# EAGLE design STorM32 Micro Logger v132 micro (EAGLE 7.5.0)
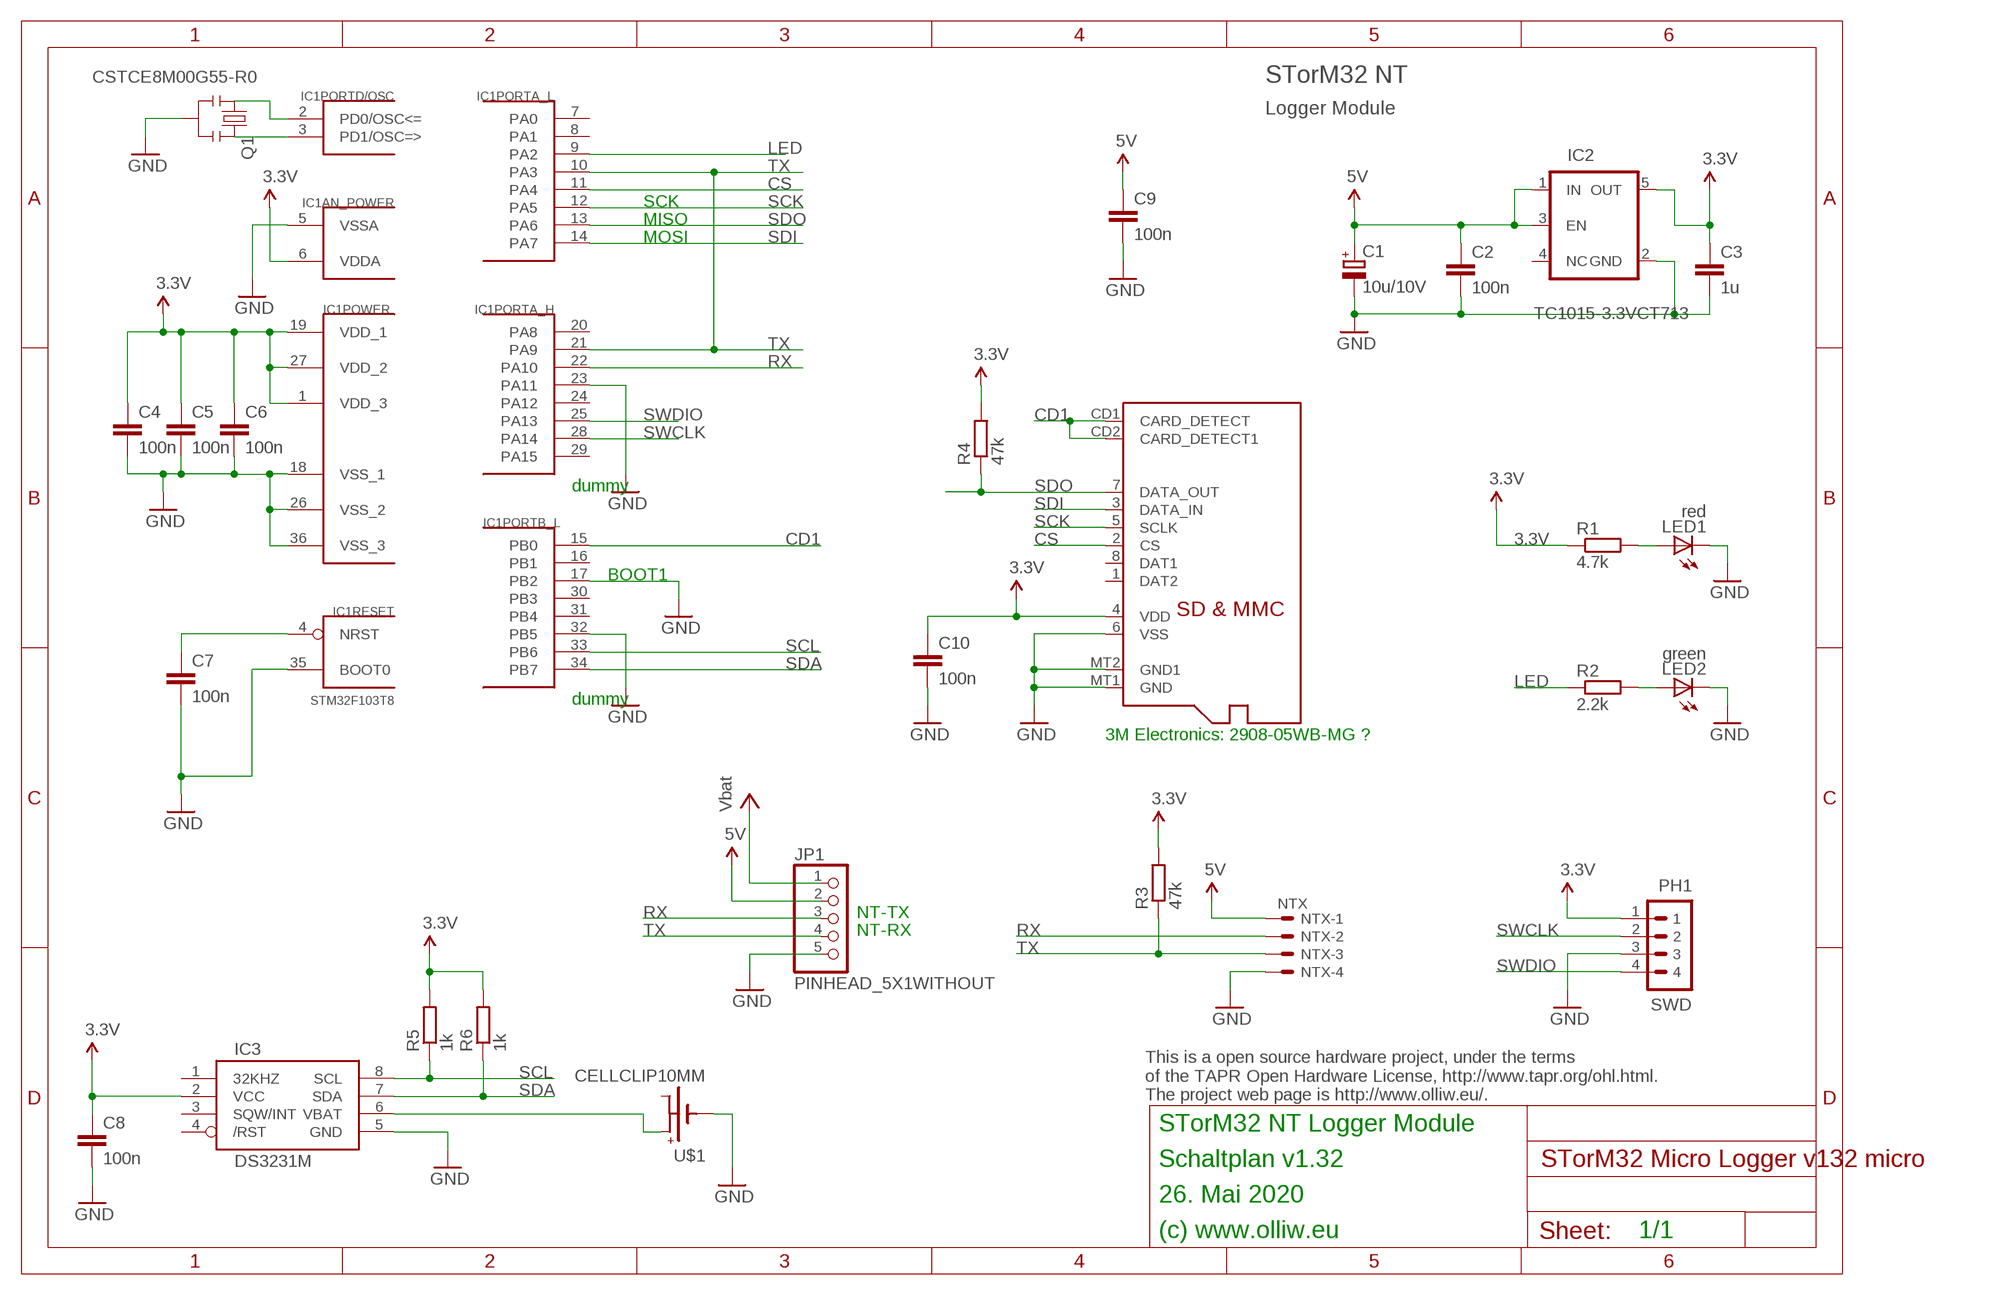
[diagram p0: schematic, sheet 1]

## Parts
C1  10u/10V  CPOL-EUSMCB  [SMC_B]
C2  100n  C-EUC0603  [C0603]
C3  1u  C-EUC0603  [C0603]
C4  100n  C-EUC0402  [C0402]
C5  100n  C-EUC0402  [C0402]
C6  100n  C-EUC0402  [C0402]
C7  100n  C-EUC0402  [C0402]
C8  100n  C-EUC0402  [C0402]
C9  100n  C-EUC0603  [C0603]
C10  100n  C-EUC0402  [C0402]
IC1  STM32F103T8  STM32F10XTXU6  [VFQFPN36]
IC2  TC1015-3.3VCT713  V_REG_TPS76433SOT23-5  [SOT23-5]
IC3  DS3231M  [SO08]
JP1  PINHEAD_5X1WITHOUT  [PINHEAD_5X1_WO]
LED1  red  LEDCHIPLED_0603  [CHIPLED_0603]
LED2  green  LEDCHIPLED_0603  [CHIPLED_0603]
NTX  NTX  SM04B-SRSS-TB  [SM04B-SRSS-TB]
PH1  SWD  P4X1_1P27-OCT_BILEX  [4X1_1P27_OCT_BILEX]
Q1  CSTCE8M00G55-R0  RESONATORSMD  [RESONATOR-SMD]
R1  4.7k  R-EU_R0402  [R0402]
R2  2.2k  R-EU_R0402  [R0402]
R3  47k  R-EU_R0402  [R0402]
R4  47k  R-EU_R0402  [R0402]
R5  1k  R-EU_R0402  [R0402]
R6  1k  R-EU_R0402  [R0402]
U1  3M 2908-05WB-MG ??  MICROSD  [MICROSD]
U$1  CELLCLIP10MM  [CELLCLIP-10MM]

## Nets
3.3V: C3.1 C4.1 C5.1 C6.1 C8.1 C10.1 IC1.1(POWER:VDD_3) IC1.6(AN_POWER:VDDA) IC1.19(POWER:VDD_1) IC1.27(POWER:VDD_2) IC2.5(OUT) IC3.2(VCC) PH1.1 R1.1 R3.2 R4.2 R5.2 R6.2 U1.4(VDD)
5V: C1.+ C2.1 C9.1 IC2.1(IN) IC2.3(EN) JP1.2 NTX.1
BAT+: IC3.6(VBAT) U$1.P$2(BAT+)
CD1: IC1.15(PORTB_L:PB0) U1.CD1(CARD_DETECT) U1.CD2(CARD_DETECT1)
CS: IC1.11(PORTA_L:PA4) U1.2(CS)
GND: C1.- C2.2 C3.2 C4.2 C5.2 C6.2 C7.2 C8.2 C9.2 C10.2 IC1.5(AN_POWER:VSSA) IC1.17(PORTB_L:PB2) IC1.18(POWER:VSS_1) IC1.23(PORTA_H:PA11) IC1.26(POWER:VSS_2) IC1.32(PORTB_L:PB5) IC1.35(RESET:BOOT0) IC1.36(POWER:VSS_3) IC2.2(GND) IC3.5(GND) JP1.5 LED1.C LED2.C NTX.4 PH1.3 Q1.2 U1.6(VSS) U1.MT1(GND) U1.MT2(GND1) U$1.P$1(GND)
LED: IC1.9(PORTA_L:PA2) R2.1
N$3: C7.1 IC1.4(RESET:NRST)
N$5: LED2.A R2.2
N$6: IC1.2(PORTD/OSC:PD0/OSC<=) Q1.1
N$7: IC1.3(PORTD/OSC:PD1/OSC=>) Q1.3
N$9: LED1.A R1.2
RX: IC1.22(PORTA_H:PA10) JP1.3 NTX.2
SCK: IC1.12(PORTA_L:PA5) U1.5(SCLK)
SCL: IC1.33(PORTB_L:PB6) IC3.8(SCL) R5.1
SDA: IC1.34(PORTB_L:PB7) IC3.7(SDA) R6.1
SDI: IC1.14(PORTA_L:PA7) U1.3(DATA_IN)
SDO: IC1.13(PORTA_L:PA6) R4.1 U1.7(DATA_OUT)
SWCLK: IC1.28(PORTA_H:PA14) PH1.2
SWDIO: IC1.25(PORTA_H:PA13) PH1.4
TX: IC1.10(PORTA_L:PA3) IC1.21(PORTA_H:PA9) JP1.4 NTX.3 R3.1
VCC: JP1.1 ; supply symbol labelled Vbat
Unconnected: IC1.7(PORTA_L:PA0) IC1.8(PORTA_L:PA1) IC1.16(PORTB_L:PB1) IC1.20(PORTA_H:PA8) IC1.24(PORTA_H:PA12) IC1.29(PORTA_H:PA15) IC1.30(PORTB_L:PB3) IC1.31(PORTB_L:PB4) IC2.4(NC) IC3.1(32KHZ) IC3.3(SQW/INT) IC3.4(/RST) U1.1(DAT2) U1.8(DAT1)

## Notes on the sheet
- STorM32 NT
- Logger Module
- SCK
- MISO
- MOSI
- dummy
- BOOT1
- dummy
- 3M Electronics: 2908-05WB-MG ?
- NT-TX
- NT-RX
- This is a open source hardware project, under the terms
  of the TAPR Open Hardware License, http://www.tapr.org/ohl.html.
  The project web page is http://www.olliw.eu/.
- STorM32 NT Logger Module
- Schaltplan v1.32
- 26. Mai 2020
- (c) www.olliw.eu | 1/1

## Library data of the parts
C1 = rcl:CPOL-EU: POLARIZED CAPACITOR, European symbol
C2-C10 = rcl:C-EU: CAPACITOR, European symbol
IC1 = # stm32:STM32F10XTXU6: STM32F101/103 36pad VFQPFN36
IC2 = # SparkFun2:V_REG_TPS76433: Voltage Regulator Older TI part. LDO 150mA regulator. No output by-pass cap option. See V_REG_LDO for a better part.
IC3 = # stdlib:DS3231M
JP1 = # stdlib:PINHEAD_5X1
LED1 LED2 = led:LED: LED OSRAM: - CHIPLED LG R971, LG N971, LY N971, LG Q971, LY Q971, LO R971, LY R971 LH N974, LH R974 LS Q976, LO Q976, LY Q976 LO Q996 - Hyper CHIPLED LW Q18S LB Q993, LB Q99A, LB R99A - SideLED LS A670, LO A670, LY A670, LG A670, LP A670 LB A673, LV A673, LT A673, LW A673 LH A674 LY A675 LS A676, LA A676, LO A676, LY A676, LW A676 LS A679, LY A679, LG A679 - Hyper Micro SIDELED® LS Y876, LA Y876, LO Y876, LY Y876 LT Y87S - SmartLED LW L88C, LW L88S LB L89C, LB L89S, LG L890 LS L89K, LO L89K, LY L89K LS L896, LA L896, LO L896, LY L896 - TOPLED LS T670, LO T670, LY T670, LG T670, LP T670 LSG T670, LSP T670, LSY T670, LOP T670, LYG T670 LG T671, LOG T671, LSG T671 LB T673, LV T673, LT T673, LW T673 LH T674 LS T676, LA T676, LO T676, LY T676, LB T676, LH T676, LSB T676, LW T676 LB T67C, LV T67C, LT T67C, LS T67K, LO T67K, LY T67K, LW E67C LS E67B, LA E67B, LO E67B, LY E67B, LB E67C, LV E67C, LT E67C LW T67C LS T679, LY T679, LG T679 LS T770, LO T770, LY T770, LG T770, LP T770 LB T773, LV T773, LT T773, LW T773 LH T774 LS E675, LA E675, LY E675, LS T675 LS T776, LA T776, LO T776, LY T776, LB T776 LHGB T686 LT T68C, LB T68C - Hyper Mini TOPLED® LB M676 - Mini TOPLED Santana® LG M470 LS M47K, LO M47K, LY M47K Source: http://www.osram.convergy.de LUXEON: - LUMILED® LXK2-PW12-R00, LXK2-PW12-S00, LXK2-PW14-U00, LXK2-PW14-V00 LXK2-PM12-R00, LXK2-PM12-S00, LXK2-PM14-U00 LXK2-PE12-Q00, LXK2-PE12-R00, LXK2-PE12-S00, LXK2-PE14-T00, LXK2-PE14-U00 LXK2-PB12-K00, LXK2-PB12-L00, LXK2-PB12-M00, LXK2-PB14-N00, LXK2-PB14-P00, LXK2-PB14-Q00 LXK2-PR12-L00, LXK2-PR12-M00, LXK2-PR14-Q00, LXK2-PR14-R00 LXK2-PD12-Q00, LXK2-PD12-R00, LXK2-PD12-S00 LXK2-PH12-R00, LXK2-PH12-S00 LXK2-PL12-P00, LXK2-PL12-Q00, LXK2-PL12-R00 Source: www.luxeon.com KINGBRIGHT: KA-3528ASYC Source: www.kingbright.com
NTX = con-jst2:?M04B-SRSS-TB: Disconnectable Crimp style connector, 1.0mm pitch 4 contacts
PH1 = # stdlib:P4X1_1P27
Q1 = # SparkFun2:RESONATOR: Resonator Small SMD resonator. This is the itty bitty 10/20MHz resonators with built in caps. CSTCE10M0G55 and CSTCE20M0V53. Footprint has been reviewed closely but hasn't been tested yet.
R1-R6 = rcl:R-EU_: RESISTOR, European symbol
U1 = # adafruit:MICROSD: Micro-SD / Transflash card holder with SPI pinout For the 3M # 2908-05WB-MG and/or 4UCON #19656 push-push type
U$1 = # stdlib:CELLCLIP

## Board
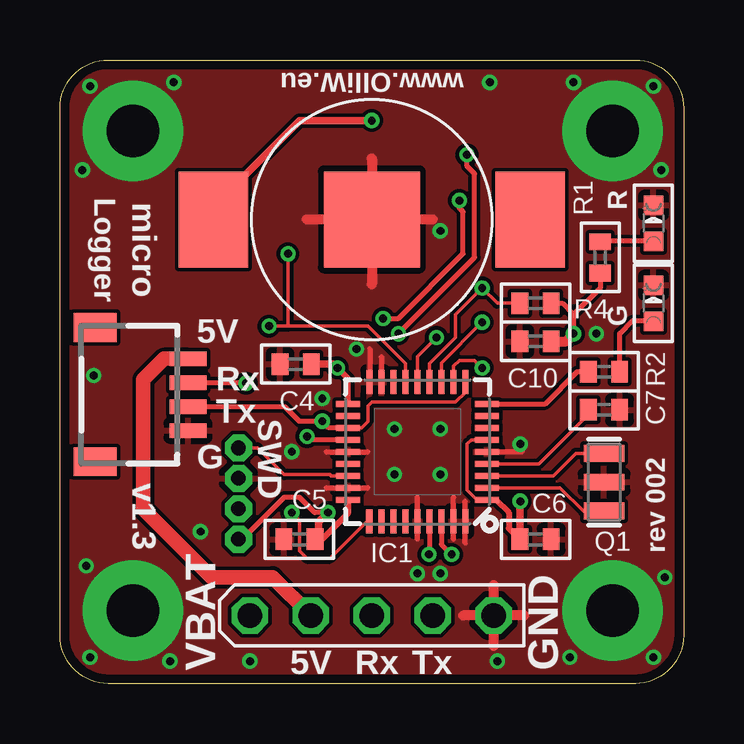
[diagram p1: board, top side]
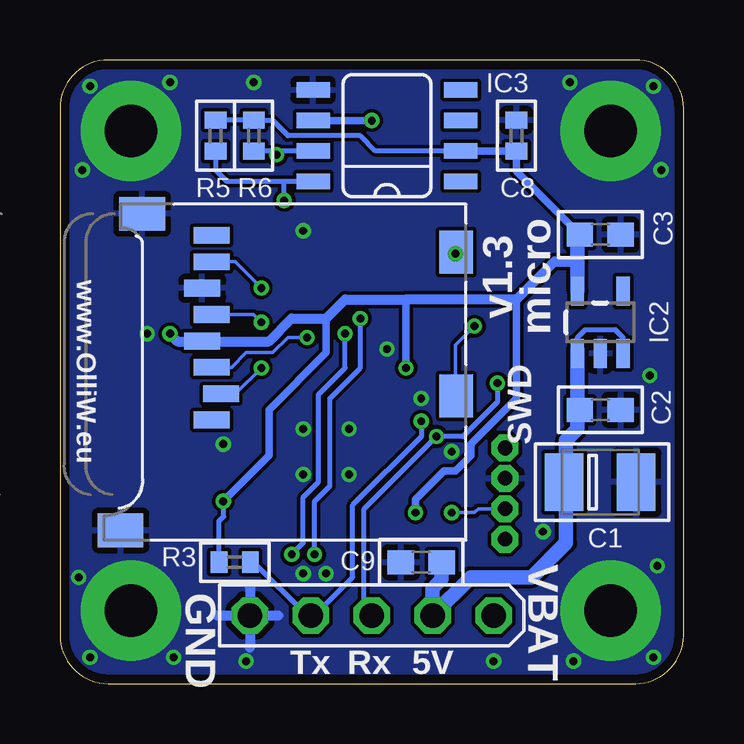
[diagram p2: board, bottom side, seen from below]

Size 26 x 26 mm. Coordinates in mm from the lower left corner, seen from the top.
Outline: 24,0 2,0 arc-90 0,2 0,24 arc-90 2,26 24,26 arc-90 26,24 26,2 arc-90 24,0
Copper layers (1*16): Top 0.035mm / dielectric 1.5mm / Bottom 0.035mm
Design rules "ShenZhen2U_2layer_EagleRules *": minimum track width 6mil, minimum drill 12mil, track to track 6mil, track to pad 6mil, pad to pad 6mil, via to via 6mil, smd to smd 0mil, copper to edge 15mil, drill to drill 10mil, minimum pad ring 10mil, minimum via ring 6mil, stop-mask expansion 2mil, vias tented up to drill 25mil, thermal gap 10mil

### Footprints (pad centres in the part's own frame; a part is rotated, then mirrored left to right if it is on the bottom)
SMC_B = smd 1.6 x 2.4: + -1.5,0; - 1.5,0
C0603 = smd 1.1 x 1: 1 -0.85,0; 2 0.85,0
C0402 = smd 0.7 x 0.9: 1 -0.65,0; 2 0.65,0
VFQFPN36 = smd 1 x 0.25: 1 -2.9,2; 2 -2.9,1.5; 3 -2.9,1; 4 -2.9,0.5; 5 -2.9,0; 6 -2.9,-0.5; 7 -2.9,-1; 8 -2.9,-1.5; 9 -2.9,-2; 19 2.9,-2; 20 2.9,-1.5; 21 2.9,-1; 22 2.9,-0.5; 23 2.9,0; 24 2.9,0.5; 25 2.9,1; 26 2.9,1.5; 27 2.9,2 | smd 0.25 x 1: 10 -2,-2.9; 11 -1.5,-2.9; 12 -1,-2.9; 13 -0.5,-2.9; 14 0,-2.9; 15 0.5,-2.9; 16 1,-2.9; 17 1.5,-2.9; 18 2,-2.9; 29 1.5,2.9; 30 1,2.9; 31 0.5,2.9; 32 0,2.9; 33 -0.5,2.9; 34 -1,2.9; 35 -1.5,2.9; 36 -2,2.9 | smd 0.27 x 1: 28 2,2.9
SOT23-5 = smd 0.55 x 1.2: 1 -0.95,-1.3; 2 0,-1.3; 3 0.95,-1.3; 4 0.95,1.3; 5 -0.95,1.3
SO08 = smd 0.66 x 1.397: 1 0,-3.073; 2 1.27,-3.073; 3 2.54,-3.073; 4 3.81,-3.073; 5 3.81,3.073; 6 2.54,3.073; 7 1.27,3.073; 8 0,3.073
PINHEAD_5X1_WO = drill 1.016 octagon: 1 0,0; 2 0,-2.54; 3 0,-5.08; 4 0,-7.62; 5 0,-10.16
CHIPLED_0603 = smd 0.8 x 0.8: A 0,-0.75; C 0,0.75
SM04B-SRSS-TB = smd 0.6 x 1.55: 1 -1.5,2.975; 2 -0.5,2.975; 3 0.5,2.975; 4 1.5,2.975 | smd 1.2 x 1.8: FIT@1 -2.8,-0.9; FIT@2 2.8,-0.9
4X1_1P27_OCT_BILEX = drill 0.61 pad 1.118 octagon: 1 0,0; 2 0,-1.27; 3 0,-2.54; 4 0,-3.81
RESONATOR-SMD = smd 0.7 x 1.7: 1 -1.2,0; 2 0,0; 3 1.2,0
R0402 = smd 0.7 x 0.9: 1 -0.65,0; 2 0.65,0
MICROSD = smd 0.7 x 1.5: 1 9,-10.64; 2 7.9,-10.24; 3 6.8,-10.64; 4 5.7,-11.04; 5 4.6,-10.64; 6 3.5,-11.04; 7 2.4,-10.64; 8 1.3,-10.64 | smd 1.8 x 1.4: CD1 2,-0.44; CD2 8,-0.44 | smd 1.4 x 1.9: MT1 0.4,-13.54; MT2 13.6,-14.44
CELLCLIP-10MM = smd 4 x 4: P$1 0,0 | smd 2.9 x 4: P$2 -6.6,0; P$3 6.6,0

### Placement (x,y rotation side)
C1  3.47,8.4 0 bottom
C2  3.47,11.41 0 bottom
C3  3.47,18.71 0 bottom
C4  9.82,13.32 180 top
C5  9.98,6.02 180 top
C6  19.83,6.02 0 top
C7  22.68,11.41 0 top
C8  6.97,22.84 90 bottom
C9  10.94,5.06 180 bottom
C10  19.83,14.27 180 top
IC1  14.9,9.67 180 top
IC2  3.47,15.06 0 bottom
IC3  12.37,20.94 90 bottom
JP1  7.92,2.84 90 top
LED1  24.75,19.19 0 top
LED2  24.75,15.86 0 top
NTX  2.36,12.05 270 top
PH1  7.44,6.02 180 top
Q1  22.68,8.4 90 top
R1  22.52,17.76 90 top
R2  22.68,13 0 top
R3  18.71,5.06 180 bottom
R4  19.83,15.86 0 top
R5  19.51,22.84 90 bottom
R6  17.92,22.84 90 bottom
U1  9.03,19.98 270 bottom
U$1  13,19.35 0 top

### Tracks (layer width: path | path; a pad name or v marks a point on that pad's centre or on a via)
3.3V  (via drill 0.33)
  Top 0.152: IC1.6 17.15,10.17 16.97,9.98 16.97,8.08 17.38,7.67 IC1.1
  Top 0.203: R4.2 20.94,15.86 21.41,15.38 | 21.41,15.38 v21.41,14.59 | R1.1 22.52,16.49 21.41,15.38 | v11.17,7.13 10.62,7.13 9.98,7.76 9.35,7.76 7.6,6.02 PH1.1
  Top 0.254: IC1.19 12,12.72 v11.57,13.16 | 10.78,6.19 C5.1 10.94,6.02 12,7.08 IC1.27 | C6.1 18.71,6.48 18.71,7.13 18.17,7.67 IC1.1
  Top 0.305: C4.1 11.41,13.32 v11.57,13.16 | v11.17,7.13 10.78,6.73 10.78,6.19 | C6.1 19.18,7.59 v19.19,7.6
  Top 0.406: C10.1 21.1,14.27 v21.41,14.59
  Bottom 0.152: 20.09,14.27 U1.4
  Bottom 0.203: IC3.2 12.84,22.21 13.48,22.84 16.49,22.84 17.14,23.49 R6.2 R5.2 | R3.2 19.37,6.78 19.18,6.97 19.18,7.59 v19.19,7.6
  Bottom 0.305: IC3.2 6.98,22.21 C8.1 6.97,21.36 C3.1 | 4.46,16.49 IC2.5 | 11.57,16.02 v11.57,13.16 | v11.17,7.13 11.17,7.68 9.98,8.87 9.51,8.87 8.87,9.51 8.87,9.98 6.97,11.89 6.97,16.02 | v19.19,7.6 17.29,9.51 17.29,11.41 14.9,13.79 14.9,15.22
  Bottom 0.406: 4.42,18.62 C3.1 | v21.41,14.59 21.1,14.27 20.09,14.27 17.29,14.27 16.33,15.22 14.9,15.22 14.11,16.02 11.57,16.02 6.97,16.02 5.38,17.6 4.42,17.6
  Bottom 0.61: IC2.5 4.42,17.6 4.42,18.62
5V
  Top 0.61: NTX.1 4.34,13.55 3.47,12.68 3.47,7.29 6.33,4.43 8.87,4.43 JP1.2
  Bottom 0.203: IC2.3 2.52,14.43 2.84,14.75 4.11,14.75 4.42,14.43 IC2.1
  Bottom 0.61: 4.9,8.96 4.9,5.86 6.33,4.43 8.87,4.43 JP1.2 10.46,3.95 10.09,4.37 C9.1 | 4.9,8.96 C1.+ | 4.9,8.96 4.9,10.14 4.43,10.62 4.43,11.41 | 4.43,11.41 4.43,13.92 IC2.1 | C2.1 4.43,11.41
BAT+  (via drill 0.33)
  Top 0.305: v13,23.48 9.98,23.48 7.13,20.62 7.29,20.23 U$1.P$2
  Bottom 0.305: IC3.6 v13,23.48
CD1  (via drill 0.33)
  Top 0.152: IC1.15 14.4,13.34 12.84,14.9 9.51,14.9 | v9.51,17.92 9.51,14.9 | v8.71,14.9 9.51,14.9
  Bottom 0.152: v8.71,14.9 9.51,14.11 9.51,12.02 U1.CD2 | U1.CD1 9.47,17.48 v9.51,17.92
CS  (via drill 0.33)
  Top 0.152: IC1.11 16.41,13.23 16.65,13.48 17.29,13.48 v17.6,13.16
  Bottom 0.152: v17.6,13.16 18.68,12.08 U1.2
GND  (via drill 0.33, 2.2 pad 4.2)
  Top 0.203: 11.1,9.67 12.84,9.67 | 14.9,6.02 14.9,7.76 | 16.89,5.86 16.89,7.6 | 13.4,13.63 13.4,12.37 | 12.92,13.95 12.92,12.52 | 16.41,6.02 16.41,7.76 | 19.27,9.67 17.52,9.67 | 11.1,8.16 12.84,8.16
  Top 0.406: 19.35,2.84 16.81,2.84 | 18.08,4.11 18.08,1.57 | 15.54,19.35 10.3,19.35 | 13,21.89 13,16.65
  Bottom 0.406: 19.43,2.84 16.89,2.84 | 18.08,4.03 18.08,1.49
  other vias: 3.04,3.04 23.04,3.04 3.04,23.04 23.04,23.04 14.9,4.59 13.95,10.62 15.86,10.62 15.86,8.71 13.95,8.71 19.19,9.98 12.37,13.95 10.94,11.89 15.86,18.87 17.92,25.06 1.41,12.84 9.67,9.67 15.86,4.59 22.37,14.59 5.86,6.33 1.25,1.09 1.09,4.9 4.59,0.93 24.75,1.09 25.22,4.43 21.26,1.09 1.25,24.91 4.75,25.06 0.93,21.41 24.75,24.91 21.41,25.06 25.06,21.41 7.92,0.93 18.24,0.93
  pour Top (isolate 0.152, rank 6): -0.02,-0.02 -0.02,26.02 26.02,26.02 26.02,-0.02
  pour Bottom (isolate 0.152, rank 6): -0.02,-0.02 -0.02,26.02 26.02,26.02 26.02,-0.02
LED
  Top 0.203: IC1.9 20.24,11.67 21.57,13 R2.1
N$3
  Top 0.152: IC1.4 19.96,9.17 21.88,11.08 C7.1
N$5
  Top 0.203: LED2.A 23.84,15.11 23.33,14.6 R2.2
N$6
  Top 0.152: IC1.2 20.85,8.17 21.82,7.2 Q1.1
N$7
  Top 0.152: IC1.3 20.57,8.67 21.5,9.6 Q1.3
N$9
  Top 0.203: LED1.A 22.71,18.44 R1.2
RX  (via drill 0.33)
  Top 0.203: NTX.2 7.74,12.55 v7.76,12.52 | IC1.22 10.48,10.17 v10.3,10.3
  Bottom 0.203: JP1.3 13.32,3.16 13.32,7.29 v10.3,10.3 9.19,10.3 7.76,11.73 v7.76,12.52
SCK  (via drill 0.33)
  Top 0.152: IC1.12 15.9,13.37 v17.6,15.06
  Bottom 0.152: U1.5 17.92,15.38 v17.6,15.06
SCL  (via drill 0.33)
  Top 0.203: IC1.33 15.4,5.4 v15.38,5.38 | v13.48,15.22 14.11,15.22 16.81,17.92 16.81,19.67 16.65,19.83 v16.65,20.14
  Bottom 0.203: 16.65,20.94 IC3.8 15.54,20.88 | 16.65,20.94 19.03,20.94 19.51,21.41 R5.1 | v15.38,5.38 15.38,7.6 14.75,8.24 14.75,11.89 13.48,13.16 v13.48,15.22 | v16.65,20.14 16.65,20.94
SDA  (via drill 0.33)
  Top 0.203: IC1.34 15.9,5.81 v16.33,5.38 | v14.11,14.59 17.29,17.76 17.29,21.26 16.97,21.57 v16.97,22.05
  Bottom 0.203: IC3.7 16.97,22.21 | 16.97,22.21 18.22,22.21 R6.1 | v16.33,5.38 15.86,5.86 15.86,7.76 15.22,8.4 15.22,12.05 14.11,13.16 v14.11,14.59 | v16.97,22.05 16.97,22.21
SDI  (via drill 0.33)
  Top 0.152: IC1.14 14.9,13.63 v15.7,14.43
  Bottom 0.152: U1.3 18.85,13.19 18.24,13.79 17.13,13.79 16.49,14.43 v15.7,14.43
SDO  (via drill 0.33)
  Top 0.152: IC1.13 15.4,13.34 16.49,14.43 16.49,15.38 v17.6,16.49 18.24,15.86 R4.1
  Bottom 0.152: U1.7 18.7,17.59 v17.6,16.49
SWCLK  (via drill 0.33)
  Top 0.152: v9.67,7.13 9.98,6.81 9.98,5.54 10.3,5.22 11.25,5.22 12.9,6.87 IC1.28
  Bottom 0.152: v9.67,7.13 8.71,7.13 8.55,7.29 PH1.2
SWDIO
  Top 0.152: PH1.4 8.24,9.82 9.35,8.71 11.25,8.71 11.3,8.67 IC1.25
TX  (via drill 0.33)
  Top 0.152: IC1.10 16.91,12.14 16.49,11.73 13,11.73 12.84,11.57 12.84,10.94 12.57,10.67 IC1.21
  Top 0.203: NTX.3 9.37,11.55 9.98,10.94 v10.94,10.94 11.21,10.67 IC1.21
  Bottom 0.203: v10.94,10.94 10.94,10.3 13.79,7.44 13.79,4.43 15.38,2.84 JP1.4 15.7,2.84 17.92,5.06 R3.1

### Text on the board
tNames: www.OlliW.eu | R | Logger | micro | G | 5V | Rx | Tx | G | SWD | rev 002 | v1.3 | VBAT | 5V | Rx | Tx | GND
bNames: micro | v1.3 | SWD | www.OlliW.eu | VBAT | GND | 5V | Rx | Tx